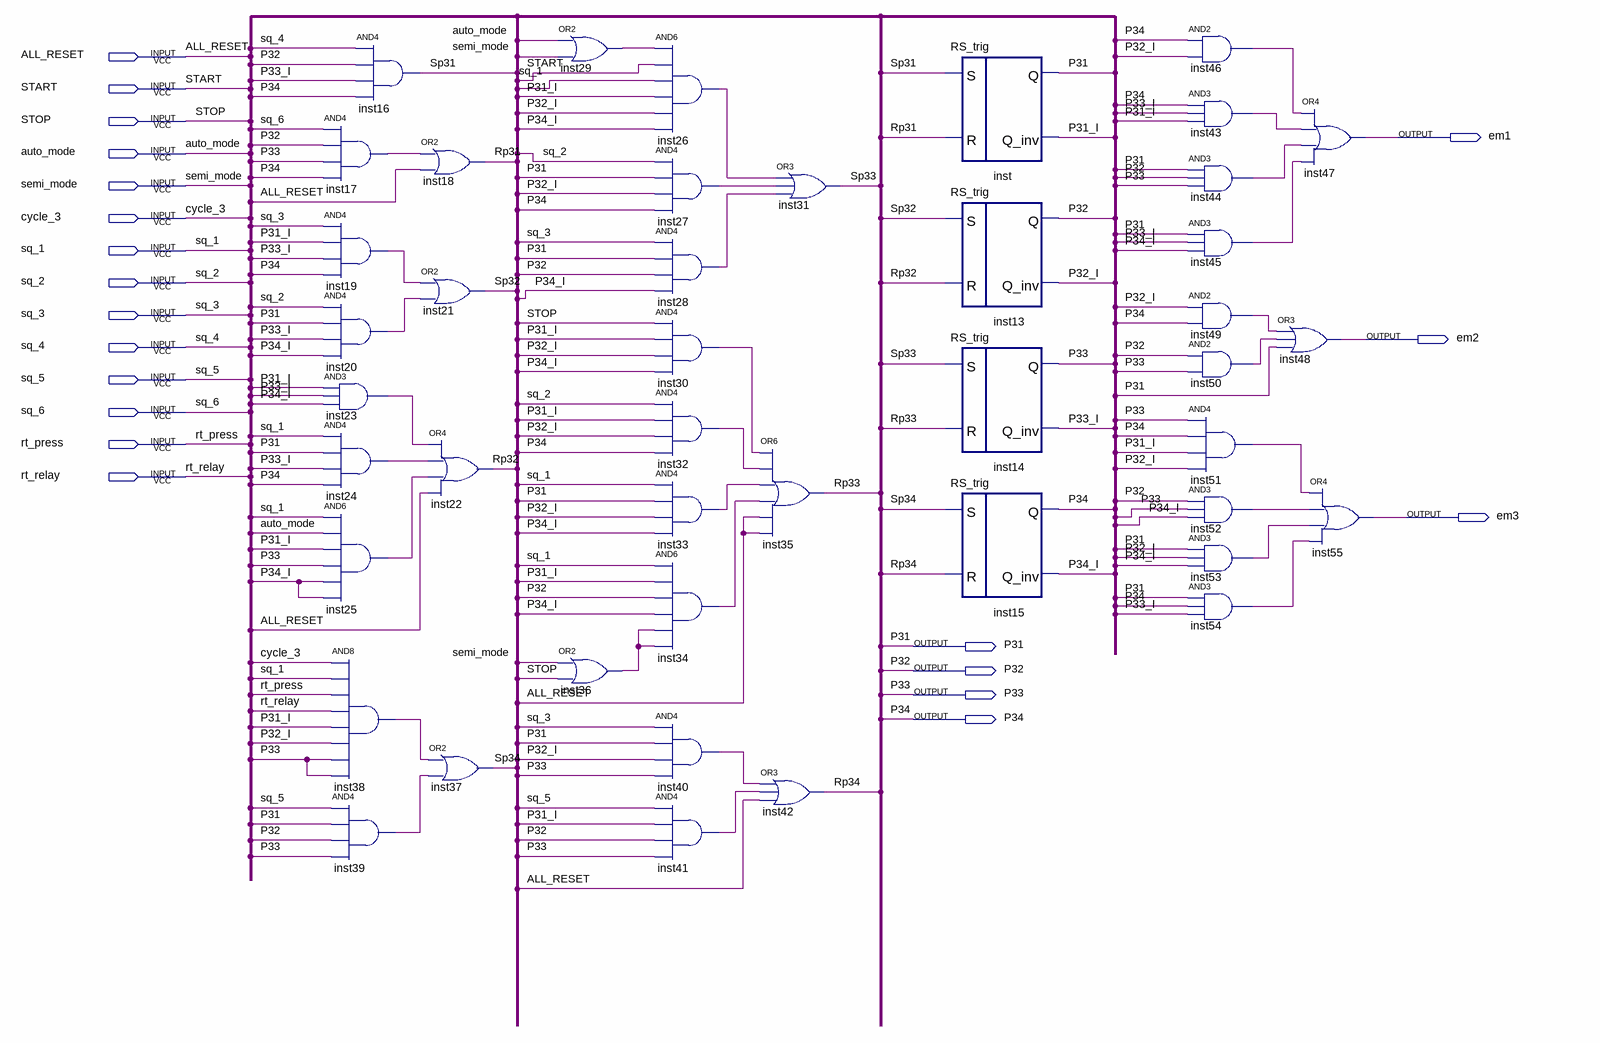
[diagram p0: schematic sheet]
// Quartus schematic cycle_3.bdf as structural Verilog: 44 symbols, 21 pins
module cycle_3 (
  input  ALL_RESET,
  input  START,
  input  STOP,
  input  auto_mode,
  input  semi_mode,
  input  cycle_3,
  input  sq_1,
  input  sq_2,
  input  sq_3,
  input  sq_4,
  input  sq_5,
  input  sq_6,
  input  rt_press,
  input  rt_relay,
  output em1,
  output em2,
  output em3,
  output P31,
  output P32,
  output P33,
  output P34
);

  wire inst17_out, inst19_out, inst20_out, inst23_out, inst24_out, inst25_out, inst26_out, inst27_out,
       inst28_out, inst29_out, inst30_out, inst32_out, inst33_out, inst34_out, inst36_out, inst38_out,
       inst39_out, inst40_out, inst41_out, inst43_out, inst44_out, inst45_out, inst46_out, inst49_out,
       inst50_out, inst51_out, inst52_out, inst53_out, inst54_out, P31_I, P32_I, P33_I, P34_I, Rp31, Rp32,
       Rp33, Rp34, Sp31, Sp32, Sp33, Sp34;

  and inst16 (Sp31, sq_4, P32, P33_I, P34);
  and inst17 (inst17_out, sq_6, P32, P33, P34);
  and inst19 (inst19_out, sq_3, P31_I, P33_I, P34);
  and inst20 (inst20_out, sq_2, P31, P33_I, P34_I);
  and inst23 (inst23_out, P31_I, P33_I, P34_I);
  and inst24 (inst24_out, sq_1, P31, P33_I, P34);
  and inst25 (inst25_out, sq_1, auto_mode, P31_I, P33, P34_I, P34_I);
  and inst38 (inst38_out, cycle_3, sq_1, rt_press, rt_relay, P31_I, P32_I, P33, P33);
  and inst39 (inst39_out, sq_5, P31, P32, P33);
  or inst18 (Rp31, inst17_out, ALL_RESET);
  or inst21 (Sp32, inst19_out, inst20_out);
  or inst22 (Rp32, inst23_out, inst24_out, inst25_out, ALL_RESET);
  or inst37 (Sp34, inst38_out, inst39_out);
  or inst29 (inst29_out, auto_mode, semi_mode);
  or inst36 (inst36_out, semi_mode, STOP);
  and inst26 (inst26_out, inst29_out, START, sq_1, P31_I, P32_I, P34_I);
  and inst27 (inst27_out, sq_2, P31, P32_I, P34);
  and inst28 (inst28_out, sq_3, P31, P32, P34_I);
  and inst30 (inst30_out, STOP, P31_I, P32_I, P34_I);
  and inst32 (inst32_out, sq_2, P31_I, P32_I, P34);
  and inst33 (inst33_out, sq_1, P31, P32_I, P34_I);
  and inst34 (inst34_out, sq_1, P31_I, P32, P34_I, inst36_out, inst36_out);
  and inst40 (inst40_out, sq_3, P31, P32_I, P33);
  and inst41 (inst41_out, sq_5, P31_I, P32, P33);
  or inst35 (Rp33, inst30_out, inst32_out, inst33_out, inst34_out, ALL_RESET, ALL_RESET);
  or inst42 (Rp34, inst40_out, inst41_out, ALL_RESET);
  or inst31 (Sp33, inst26_out, inst27_out, inst28_out);
  RS_trig inst (.S(Sp31), .R(Rp31), .Q(P31), .Q_inv(P31_I));
  RS_trig inst13 (.S(Sp32), .R(Rp32), .Q(P32), .Q_inv(P32_I));
  RS_trig inst14 (.S(Sp33), .R(Rp33), .Q(P33), .Q_inv(P33_I));
  RS_trig inst15 (.S(Sp34), .R(Rp34), .Q(P34), .Q_inv(P34_I));
  and inst46 (inst46_out, P34, P32_I);
  and inst43 (inst43_out, P34, P33_I, P31_I);
  and inst44 (inst44_out, P31, P32, P33);
  and inst45 (inst45_out, P31, P33_I, P34_I);
  and inst49 (inst49_out, P32_I, P34);
  and inst50 (inst50_out, P32, P33);
  and inst51 (inst51_out, P33, P34, P31_I, P32_I);
  and inst52 (inst52_out, P32, P33, P34_I);
  and inst53 (inst53_out, P31, P32_I, P34_I);
  and inst54 (inst54_out, P31, P34, P33_I);
  or inst48 (em2, inst49_out, inst50_out, P31);
  or inst47 (em1, inst46_out, inst43_out, inst44_out, inst45_out);
  or inst55 (em3, inst51_out, inst52_out, inst53_out, inst54_out);
endmodule
